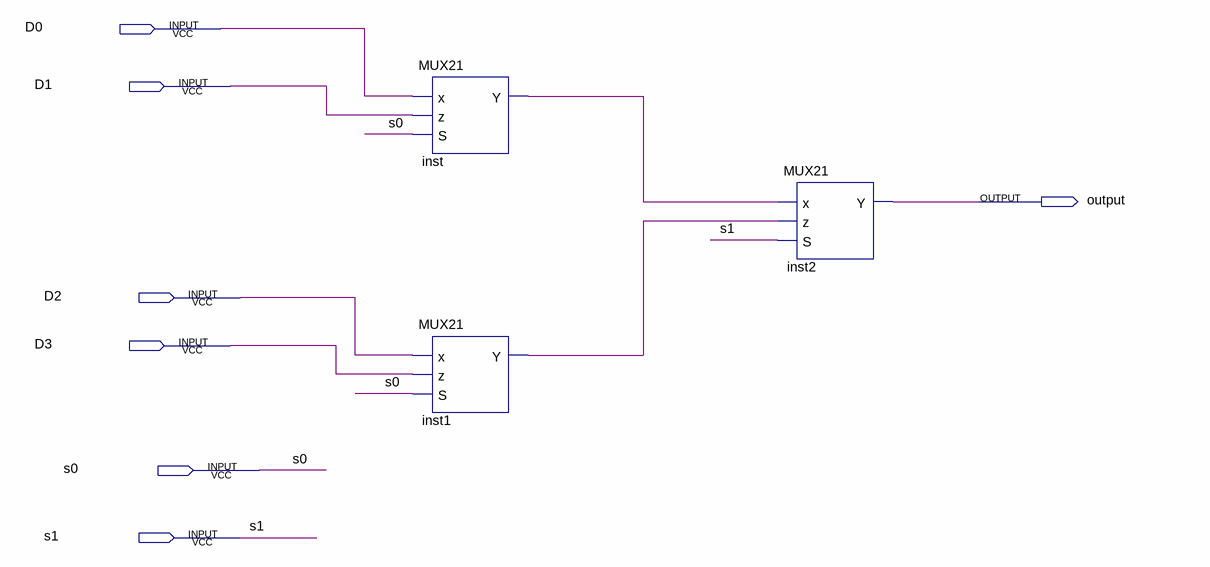
[diagram p0: schematic sheet]
// Quartus schematic mux41.bdf as structural Verilog: 3 symbols, 7 pins
module mux41 (
  input  D0,
  input  D1,
  input  D2,
  input  D3,
  input  s0,
  input  s1,
  output \output 
);

  wire inst1_y, inst_y;

  MUX21 inst (.x(D0), .z(D1), .S(s0), .Y(inst_y));
  MUX21 inst1 (.x(D2), .z(D3), .S(s0), .Y(inst1_y));
  MUX21 inst2 (.x(inst_y), .z(inst1_y), .S(s1), .Y(\output ));
endmodule
